# Altium schematic sheet AOCS.SchDoc
size A4; SheetNumber: 4; SheetTotal: 12
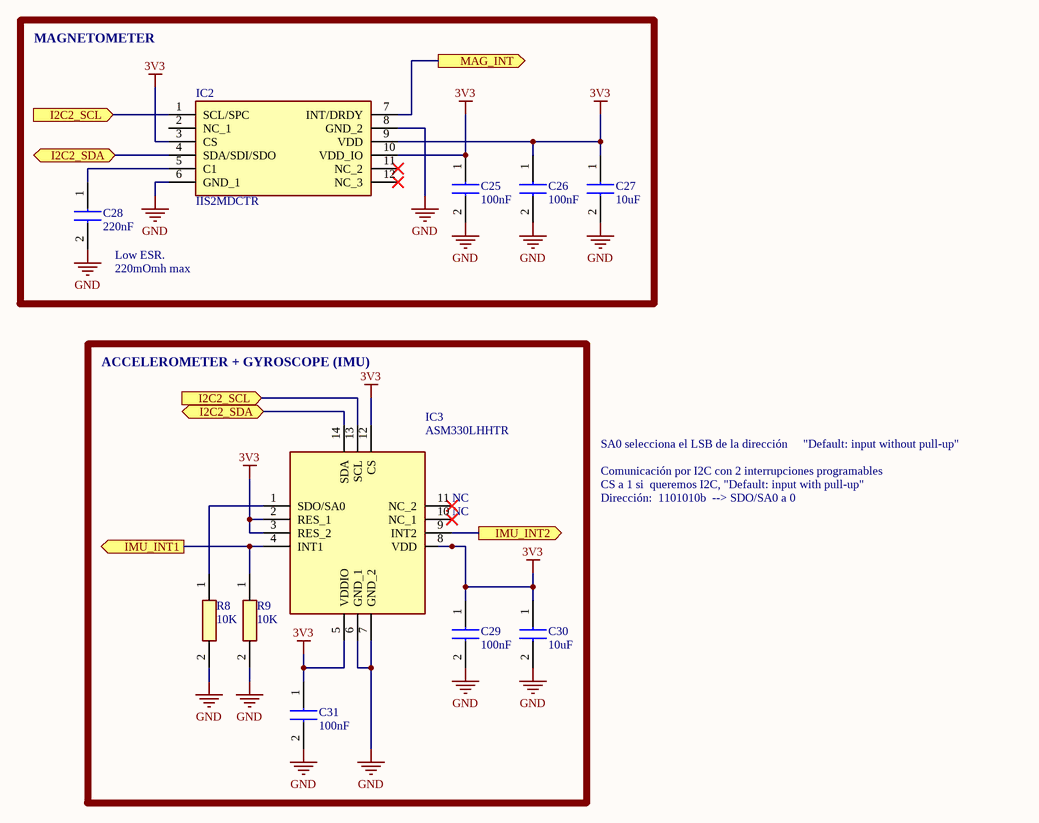
[diagram p0: AOCS.SchDoc]

## Parts
C25  100nF  [CAPC1608X95N]
C26  100nF  [CAPC1608X95N]
C27  10uF  [CAPC1608X90N]
C28  220nF  [C0603]
C29  100nF  [CAPC1608X95N]
C30  10uF  [CAPC1608X90N]
C31  100nF  [CAPC1608X95N]
IC2  IIS2MDCTR  [IIS2MDCTR]
IC3  ASM330LHHTR  [LGA-14(2.5X3X0.86)]
R8  10K  [RESC1508X50N]
R9  10K  [RESC1508X50N]

## Blocks framed on the sheet
MAGNETOMETER: C25-C28 IC2
ACCELEROMETER + GYROSCOPE (IMU): C29-C31 IC3 R8 R9

## Ports
I2C2_SCL (in), I2C2_SDA (bidir), IMU_INT1 (out), IMU_INT2 (out), MAG_INT (out)

## Nets
3V3: C25.1 C26.1 C27.1 C29.1 C30.1 C31.1 IC2.3(CS) IC2.9(VDD) IC2.10(VDD_IO) IC3.2(RES_1) IC3.3(RES_2) IC3.5(VDDIO) IC3.8(VDD) IC3.12(CS)
GND: C25.2 C26.2 C27.2 C28.2 C29.2 C30.2 C31.2 IC2.6(GND_1) IC2.8(GND_2) IC3.6(GND_1) IC3.7(GND_2) R8.2 R9.2
I2C2_SCL: IC2.1(SCL/SPC) IC3.13(SCL) ; port I2C2_SCL
I2C2_SDA: IC2.4(SDA/SDI/SDO) IC3.14(SDA) ; port I2C2_SDA
IMU_INT1: IC3.4(INT1) R9.1 ; port IMU_INT1
IMU_INT2: IC3.9(INT2) ; port IMU_INT2
MAG_INT: IC2.7(INT/DRDY) ; port MAG_INT
NetC28_1: C28.1 IC2.5(C1)
NetIC3_1: IC3.1(SDO/SA0) R8.1

Not connected (* = marked no-connect by the designer): IC2 2(NC_1) 11(NC_2)* 12(NC_3)*; IC3 10(NC_1)* 11(NC_2)*

## Notes on the sheet
- (near C28) Low ESR.
- (near C28) 220mOmh max
- (near IC3) NC
- Comunicación por I2C con 2 interrupciones programables
- CS a 1 si  queremos I2C, "Default: input with pull-up"
- SA0 selecciona el LSB de la dirección
- Dirección:  1101010b  --> SDO/SA0 a 0
- "Default: input without pull-up"

## Library data of the parts
C25 C26 C29 C31 = C0603C104M4RAC7867: 0.1 µF ±20% 16V Ceramic Capacitor X7R 0603 (1608 Metric); Manufacturer_Name: KEMET; Datasheet Link: https://www.arrow.com/en/products/c0603c104m4rac7867/kemet-corporation?region=nac; Height: 0.95mm; Manufacturer_Part_Number: C0603C104M4RAC7867; Mouser Part Number: N/A; Mouser Price/Stock: https://www.mouser.co.uk/ProductDetail/KEMET/C0603C104M4RAC7867?qs=nAEW9fCjKd%252BI998RVtZhZQ%3D%3D; Arrow Part Number: C0603C104M4RAC7867; Arrow Price/Stock: https://www.arrow.com/en/products/c0603c104m4rac7867/kemet-corporation?region=europe
C27 C30 = GRM188D71A106KA73D: CAP CER 10UF 10V X7T 0603; Manufacturer_Name: Murata Electronics; Datasheet Link: https://psearch.en.murata.com/capacitor/product/GRM188D71A106KA73%23.html; Height: 0.9mm; Manufacturer_Part_Number: GRM188D71A106KA73D; Mouser Part Number: 81-GRM188D71A106KA3D; Mouser Price/Stock: https://www.mouser.co.uk/ProductDetail/Murata-Electronics/GRM188D71A106KA73D?qs=FvQ4nYu%252B2He2GIhYKxXmMQ%3D%3D; Arrow Part Number: GRM188D71A106KA73D; Arrow Price/Stock: https://www.arrow.com/en/products/grm188d71a106ka73d/murata-manufacturing?region=nac
C28 = C0603C224K4RECAUTO: 0.22 µF ±10% 16V Ceramic Capacitor X7R 0603 (1608 Metric); Manufacturer_Name: KEMET; Datasheet Link: https://content.kemet.com/datasheets/KEM_C1090_X7R_ESD.pdf; Height: 0.87mm; Manufacturer_Part_Number: C0603C224K4RECAUTO; Mouser Part Number: 80-C0603C224K4RECAUT; Mouser Price/Stock: https://www.mouser.co.uk/ProductDetail/KEMET/C0603C224K4RECAUTO?qs=MLItCLRbWszB36u3S8vAZQ%3D%3D; Arrow Part Number: C0603C224K4RECAUTO; Arrow Price/Stock: https://www.arrow.com/en/products/c0603c224k4recauto/kemet-corporation
IC2 = IIS2MDCTR: Magnetoresistive Sensor X, Y, Z Axis 12-LGA (2x2); Manufacturer_Name: STMicroelectronics; Datasheet Link: https://www.st.com/resource/en/datasheet/iis2mdc.pdf; Height: 0.7mm; Manufacturer_Part_Number: IIS2MDCTR; Mouser Part Number: 511-IIS2MDCTR; Mouser Price/Stock: https://www.mouser.co.uk/ProductDetail/STMicroelectronics/IIS2MDCTR?qs=1mbolxNpo8ems1K%2FRdQzXg%3D%3D; Arrow Part Number: IIS2MDCTR; Arrow Price/Stock: https://www.arrow.com/en/products/iis2mdctr/stmicroelectronics?region=nac
IC3 = ASM330LHHTR: Accelerometer, Gyroscope, Temperature, 6 Axis Sensor I²C, SPI Output; Manufacturer_Name: STMicroelectronics; Datasheet Link: https://www.st.com/resource/en/datasheet/asm330lhh.pdf; Manufacturer_Part_Number: ASM330LHHTR; Mouser Part Number: 511-ASM330LHHTR; Mouser Price/Stock: https://www.mouser.co.uk/ProductDetail/STMicroelectronics/ASM330LHHTR?qs=lc2O%252BfHJPVYgP8P9MzExKQ%3D%3D; Arrow Part Number: ASM330LHHTR; Arrow Price/Stock: https://www.arrow.com/en/products/asm330lhhtr/stmicroelectronics?region=nac
R8 R9 = RNCP0603FTD10K0: 10 kOhms ±1% 0.125W, 1/8W Chip Resistor 0603 (1608 Metric) Anti-Sulfur Thin Film; Manufacturer_Name: Stackpole Electronics; Datasheet Link: https://cs.seielect.com/catalog/SEI-RNCP.pdf; Height: 0.5mm; Manufacturer_Part_Number: RNCP0603FTD10K0; Mouser Part Number: 708-RNCP0603FTD10K0; Mouser Price/Stock: https://www.mouser.co.uk/ProductDetail/SEI-Stackpole/RNCP0603FTD10K0?qs=FESYatJ8odL1jmHQSpKOPg%3D%3D; Arrow Part Number: RNCP0603FTD10K0; Arrow Price/Stock: https://www.arrow.com/en/products/rncp0603ftd10k0/stackpole-electronics?region=nac